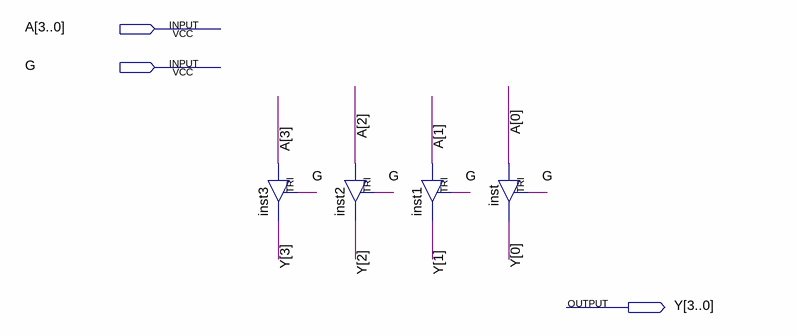
[diagram p0: schematic sheet]
// Quartus schematic TRISTATE_4BITS.bdf as structural Verilog: 4 symbols, 3 pins
module TRISTATE_4BITS (
  input  [3:0] A,
  input  G,
  output [3:0] Y
);

  TRI inst3 (.IN(A[3]), .OE(G), .OUT(Y[3]));
  TRI inst2 (.IN(A[2]), .OE(G), .OUT(Y[2]));
  TRI inst1 (.IN(A[1]), .OE(G), .OUT(Y[1]));
  TRI inst (.IN(A[0]), .OE(G), .OUT(Y[0]));
endmodule
